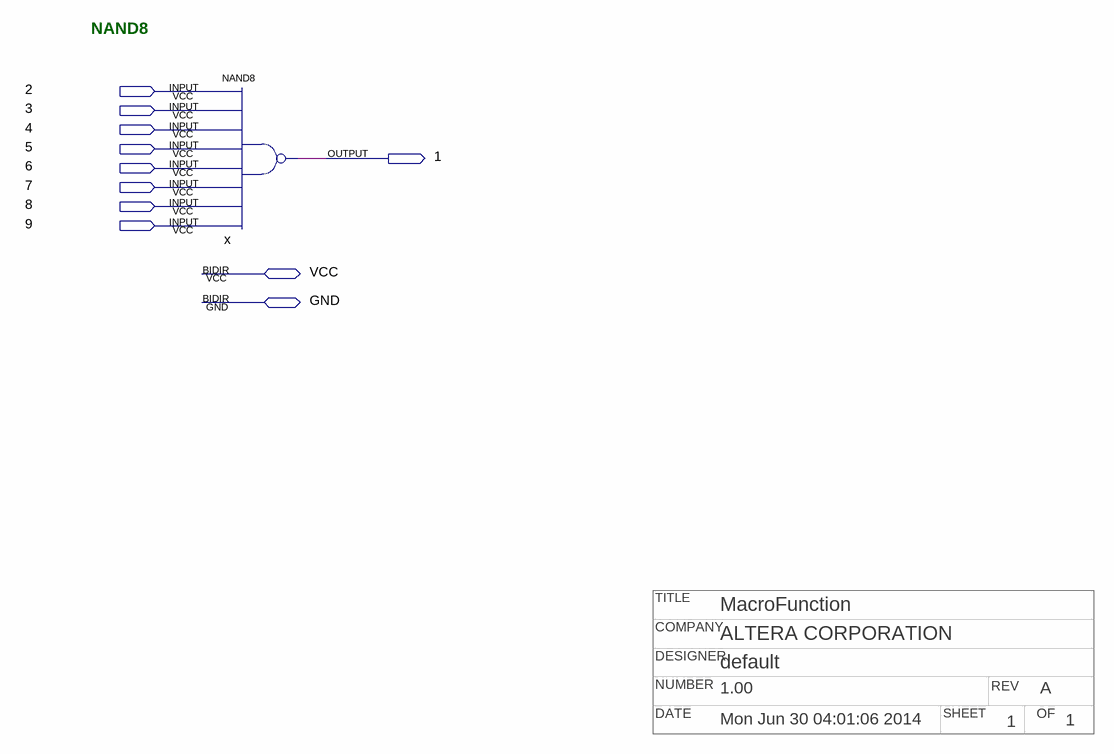
[diagram p0: schematic sheet]
// Quartus schematic npnand8.bdf as structural Verilog: 1 symbols, 11 pins
// Title block: TITLE: MacroFunction; COMPANY: ALTERA CORPORATION; DESIGNER: default; NUMBER: 1.00; REV: A; DATE: Mon Jun 30 04:01:06 2014; SHEET: 1; OF: 1
module npnand8 (
  input  \2 ,
  input  \3 ,
  input  \4 ,
  input  \5 ,
  input  \6 ,
  input  \7 ,
  input  \8 ,
  input  \9 ,
  inout  VCC,
  inout  GND,
  output \1 
);

  nand x (\1 , \2 , \3 , \4 , \5 , \6 , \7 , \8 , \9 );

  // Notes on the sheet:
  //   NAND8
endmodule
